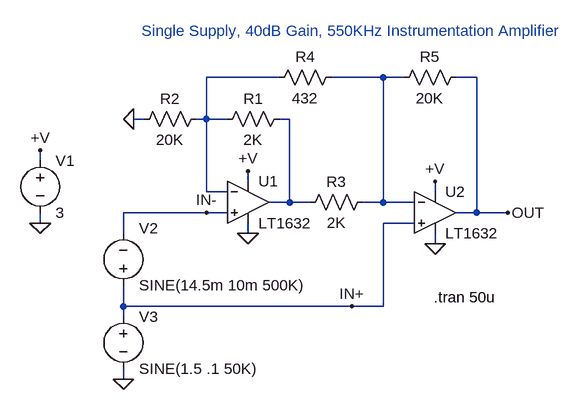
[diagram p0: schematic 1632.asc]
1632.asc, the LTspice schematic file:
Version 4
SHEET 1 896 680
WIRE 240 48 128 48
WIRE 400 48 320 48
WIRE 432 48 400 48
WIRE 544 48 512 48
WIRE 32 112 16 112
WIRE 128 112 128 48
WIRE 128 112 112 112
WIRE 160 112 128 112
WIRE 256 112 240 112
WIRE -128 176 -128 160
WIRE 192 208 192 192
WIRE 128 224 128 112
WIRE 160 224 128 224
WIRE 480 224 480 208
WIRE 256 240 256 112
WIRE 256 240 224 240
WIRE 288 240 256 240
WIRE 400 240 400 48
WIRE 400 240 368 240
WIRE 448 240 400 240
WIRE 128 256 0 256
WIRE 160 256 128 256
WIRE 544 256 544 48
WIRE 544 256 512 256
WIRE 592 256 544 256
WIRE -128 272 -128 256
WIRE 448 272 400 272
WIRE 0 288 0 256
WIRE 192 288 192 272
WIRE 480 304 480 288
WIRE 0 400 0 368
WIRE 352 400 0 400
WIRE 400 400 400 272
WIRE 400 400 352 400
WIRE 0 416 0 400
WIRE 0 512 0 496
FLAG -128 272 0
FLAG 192 192 +V
FLAG -128 160 +V
FLAG 16 112 0
FLAG 192 288 0
FLAG 480 208 +V
FLAG 480 304 0
FLAG 128 256 IN-
FLAG 352 400 IN+
FLAG 0 512 0
FLAG 592 256 OUT
SYMBOL voltage -128 160 R0
SYMATTR InstName V1
SYMATTR Value 3
SYMBOL res 256 96 R90
WINDOW 0 0 56 VBottom 0
WINDOW 3 32 56 VTop 0
SYMATTR InstName R1
SYMATTR Value 2K
SYMBOL res 128 96 R90
WINDOW 0 0 56 VBottom 0
WINDOW 3 32 56 VTop 0
SYMATTR InstName R2
SYMATTR Value 20K
SYMBOL opamps\\LT1632 192 176 R0
SYMATTR InstName U1
SYMBOL res 384 224 R90
WINDOW 0 0 56 VBottom 0
WINDOW 3 32 56 VTop 0
SYMATTR InstName R3
SYMATTR Value 2K
SYMBOL res 336 32 R90
WINDOW 0 0 56 VBottom 0
WINDOW 3 32 56 VTop 0
SYMATTR InstName R4
SYMATTR Value 432
SYMBOL res 528 32 R90
WINDOW 0 0 56 VBottom 0
WINDOW 3 32 56 VTop 0
SYMATTR InstName R5
SYMATTR Value 20K
SYMBOL opamps\\LT1632 480 192 R0
SYMATTR InstName U2
SYMBOL voltage 0 384 M180
WINDOW 0 24 104 Left 0
WINDOW 3 24 16 Left 0
SYMATTR InstName V2
SYMATTR Value SINE(14.5m 10m 500K)
SYMBOL voltage 0 400 R0
SYMATTR InstName V3
SYMATTR Value SINE(1.5 .1 50K)
TEXT 478 386 Left 0 !.tran 50u
TEXT 352 -8 Bottom 0 ;Single Supply, 40dB Gain, 550KHz Instrumentation Amplifier

The netlist it stands for:
* 1632.asc
V1 +V 0 3
R1 N003 N001 2K
R2 N001 0 20K
XU1 IN- N001 +V 0 N003 LT1632  ; pins In+ In- V+ V- OUT
R3 N002 N003 2K
R4 N002 N001 432
R5 OUT N002 20K
XU2 IN+ N002 +V 0 OUT LT1632  ; pins In+ In- V+ V- OUT
V2 IN+ IN- SINE(14.5m 10m 500K)
V3 IN+ 0 SINE(1.5 .1 50K)
.tran 50u
* Single Supply, 40dB Gain, 550KHz Instrumentation Amplifier
.lib LTC.lib
.backanno
.end